# EasyEDA schematic SCH_0321_2023-05-09.json
TITLE: Sheet_1; REV: 1.0; Date: 2023-03-21; Sheet: 1/1; Drawn By: yubinininin; Company: Your Company
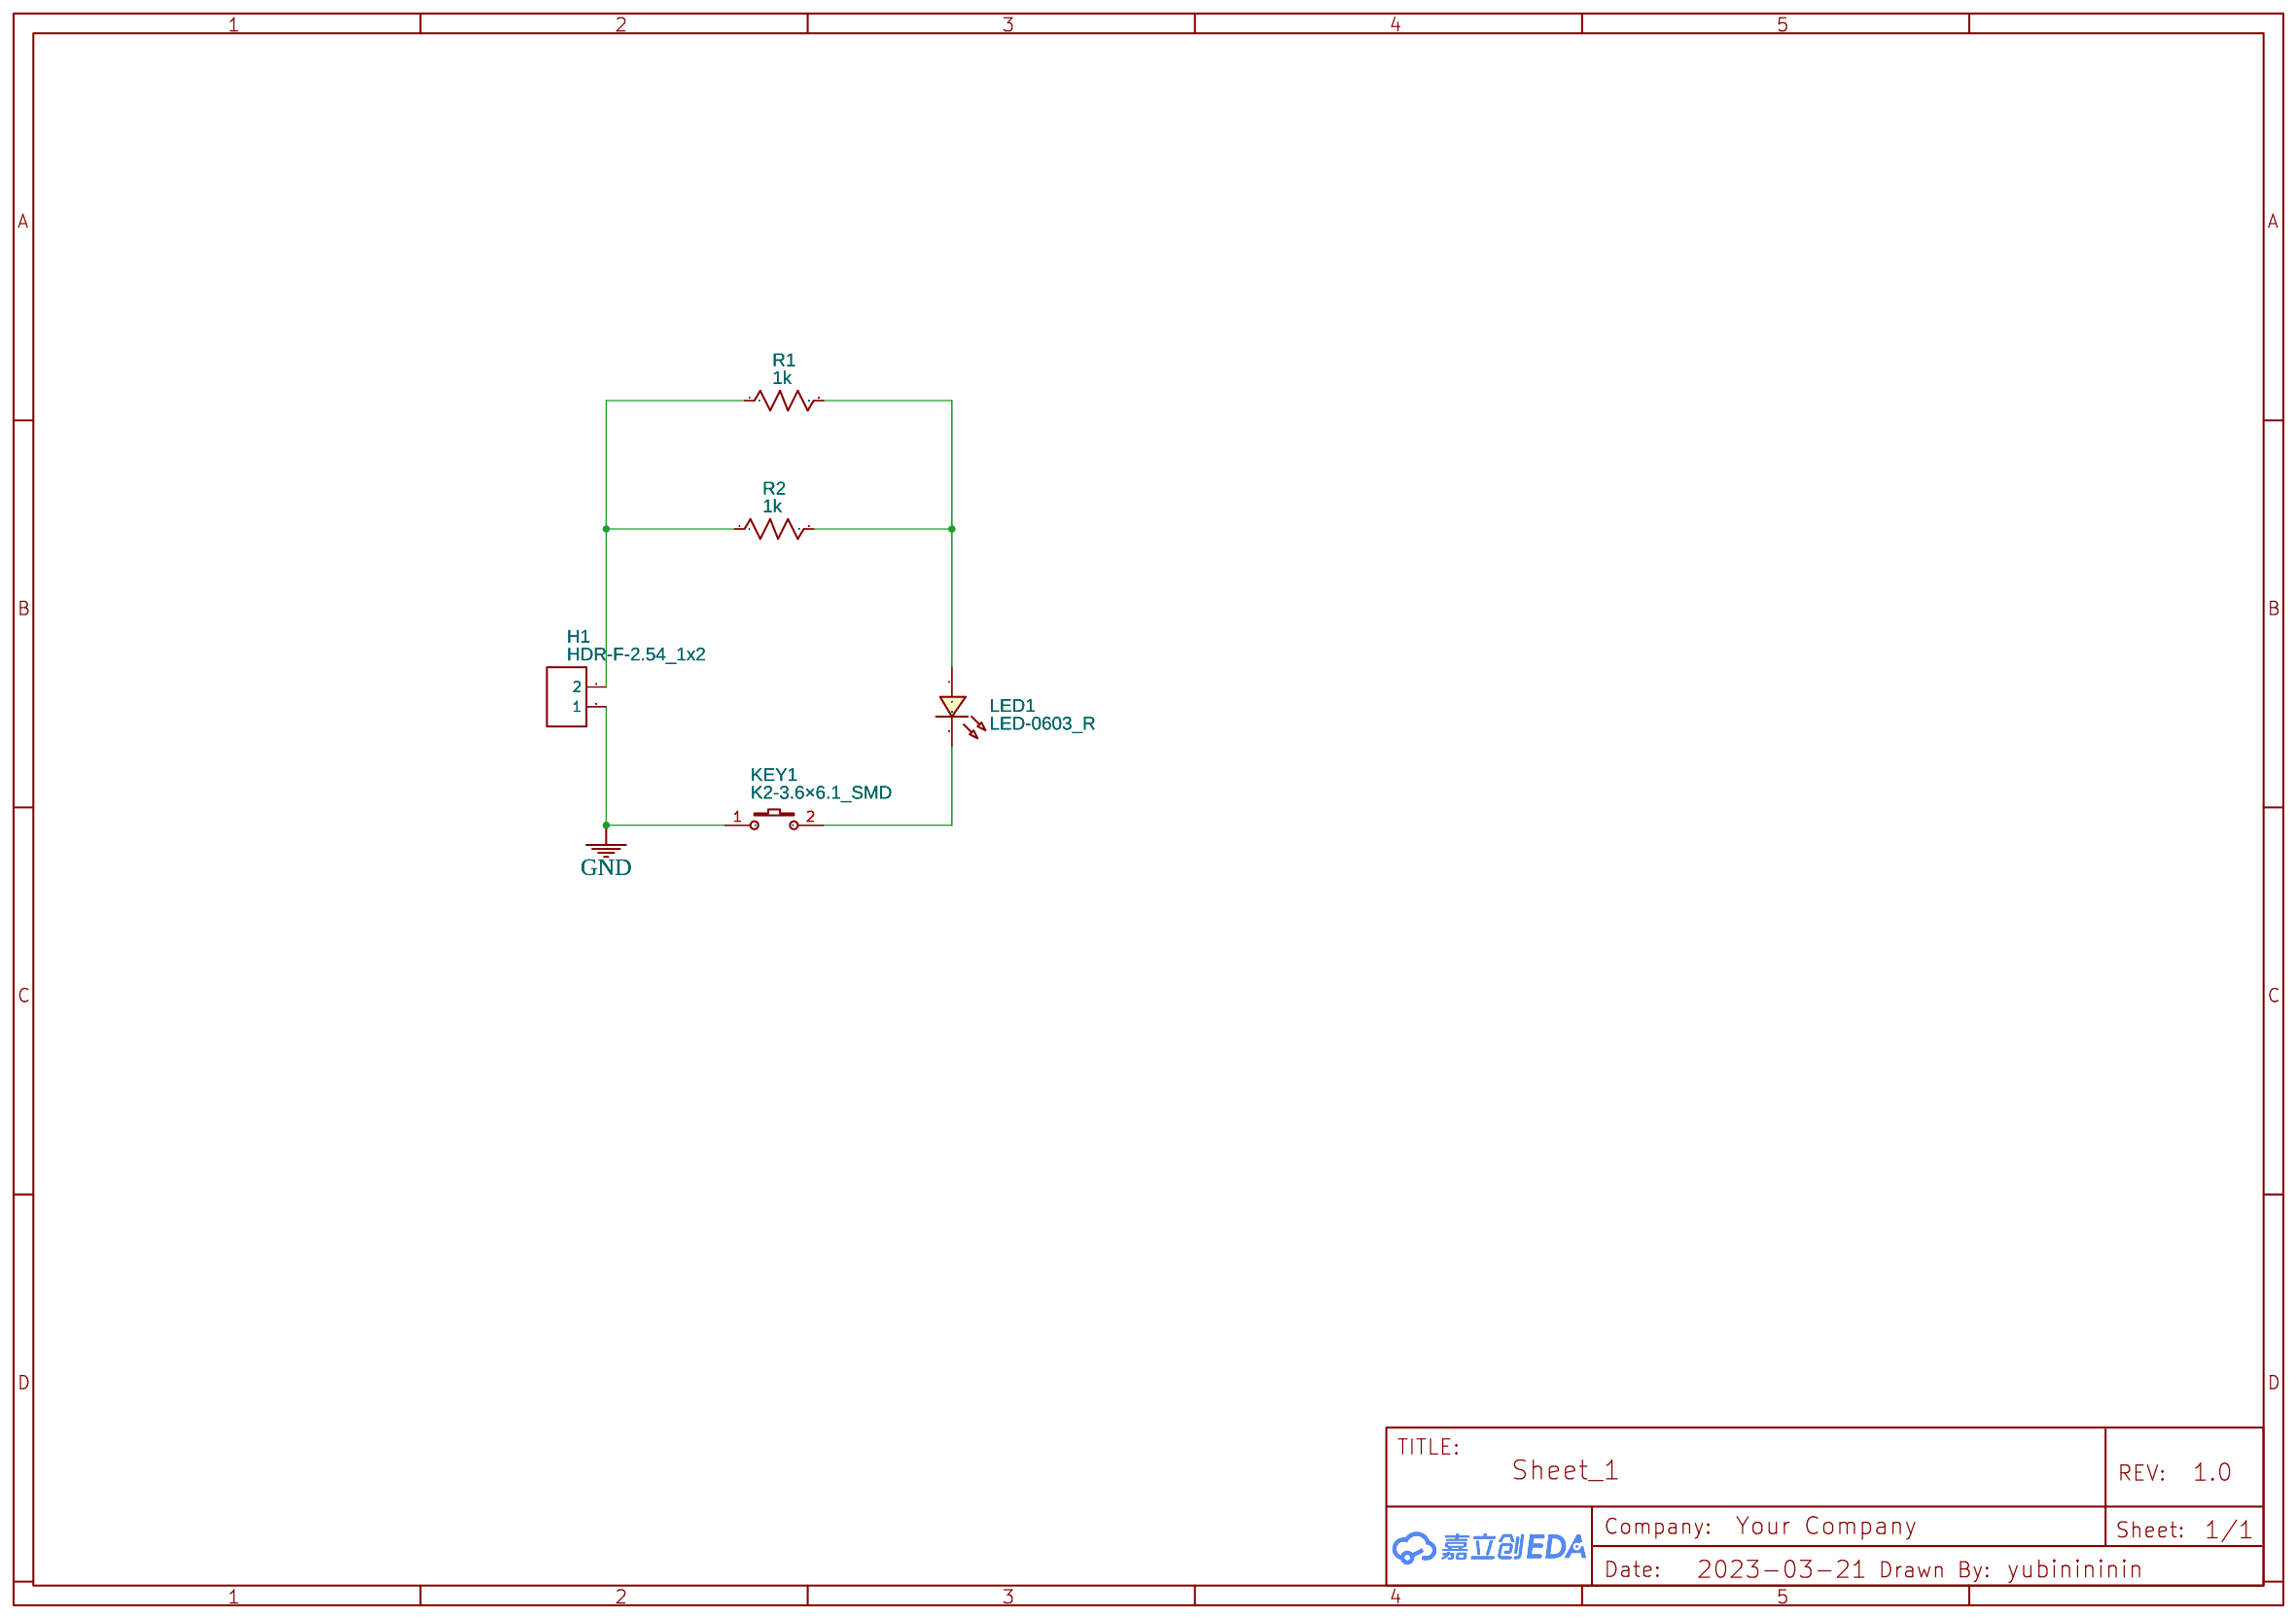
[diagram p0: schematic sheet]

## Parts
H1  HDR-F-2.54_1x2  [HDR-F-2.54_1X2]
KEY1  K2-3.6×6.1_SMD  [KEY-SMD_2P-L6.2-W3.6-LS8.0]
LED1  LED-0603_R  [LED0603_RED]
R1  1k  [R0603]
R2  1k  [R0603]

## Library data of the parts
H1 = HDR-F-2.54_1x2: Supplier Part: C49661; Supplier: LCSC; Contributor: LCEDA_Lib
KEY1 = K2-3.6×6.1_SMD: Supplier Part: C118141; Supplier: LCSC; Manufacturer Part: K2-1107ST-A4SW-06; Contributor: LCEDA_Lib; 制造商: 韩国韩荣
LED1 = LED-0603_R: Manufacturer: EVERLIGHT(台湾亿光); Manufacturer Part: 19-217/R6C-AL1M2VY/3T; Supplier Part: C72044; Supplier: LCSC; Contributor: LCEDA_01
R1 R2 = R_0603_US: Contributor: LCEDA_Lib

## Nets
GND: H1.1 KEY1.1
Net-(H1-2): H1.2 R1.1 R2.1
Net-(KEY1-2): KEY1.2 LED1.2
Net-(LED1-1): LED1.1 R1.2 R2.2
